# Altium schematic sheet SCH - Peripheral.SchDoc
size A4; CompanyName: James Cook University; DrawnBy1: Jacob Finger; Organization: James Cook University; Title1: AS1 SCH - Peripherals; Revision: 1.2; SheetNumber: 2; SheetTotal: 3; Title2: Mic, Oscillator, IMUs & Switch; DrawnBy2: Liam McLaren; ProjectName: *ProjectName
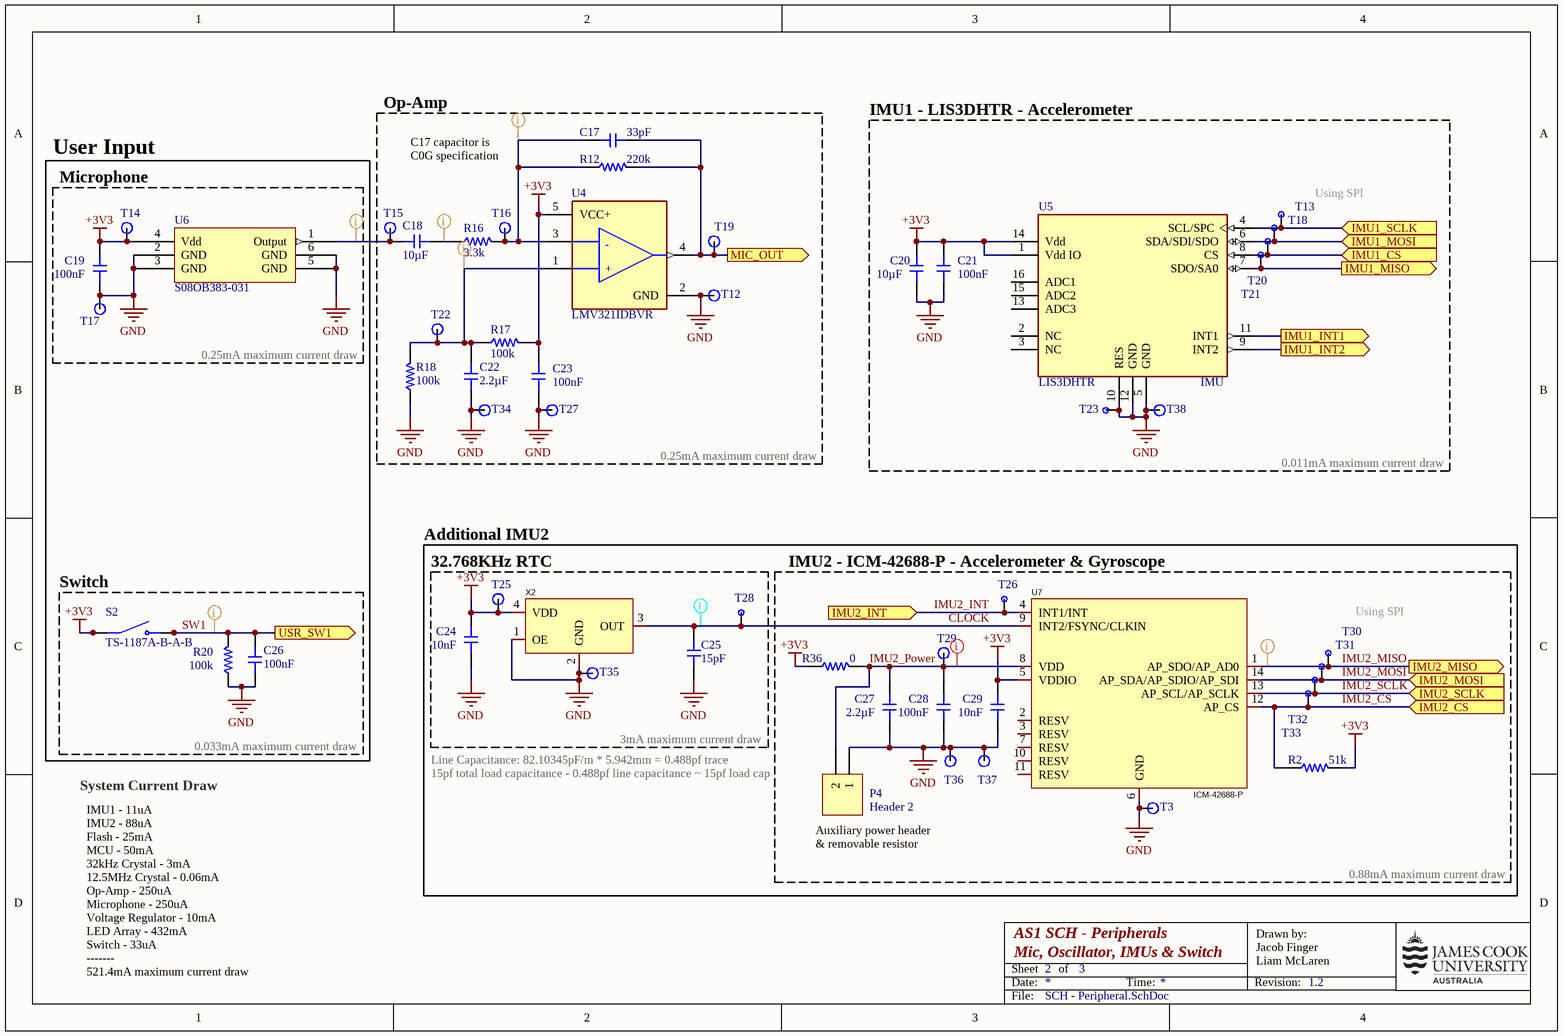
[diagram p0: SCH - Peripheral.SchDoc]

## Parts
C17  value 33pF  [CAP-0402]  (hidden comment: 0402CG330J500NT)
C18  value 10µF  [CAP-0402]  (hidden comment: CL05A106MQ5NUNC)
C19  value 100nF  [CAP-0402]  (hidden comment: CL05B104KB54PNC)
C20  value 10µF  [CAP-0402]  (hidden comment: CL05A106MQ5NUNC)
C21  value 100nF  [CAP-0402]  (hidden comment: CL05B104KB54PNC)
C22  value 2.2µF  [CAP-0402]  (hidden comment: CL05A225MQ5NSNC)
C23  value 100nF  [CAP-0402]  (hidden comment: CL05B104KB54PNC)
C24  value 10nF  [CAP-0402]  (hidden comment: CL05B103KB5NNNC)
C25  value 15pF  [CAP-0402]  (hidden comment: 0402CG150J500NT)
C26  value 100nF  [CAP-0402]  (hidden comment: CL05B104KO5NNNC)
C27  value 2.2µF  [CAP-0402]  (hidden comment: CL05A225MQ5NSNC)
C28  value 100nF  [CAP-0402]  (hidden comment: CL05B104KB54PNC)
C29  value 10nF  [CAP-0402]  (hidden comment: CL05B103KB5NNNC)
P4  Header 2  [HDR1X2]  (no BOM)
R2  value 51k  [RES-0402]  (hidden comment: 0402WGF5102TCE)
R12  value 220k  [RES-0603]  (hidden comment: 0603WAF2203T5E)
R16  value 3.3k  [RES-0402]  (hidden comment: 0402WGF3301TCE)
R17  value 100k  [RES-0402]  (hidden comment: 0402WGF1003TCE)
R18  value 100k  [RES-0402]  (hidden comment: 0402WGF1003TCE)
R20  value 100k  [RES-0402]  (hidden comment: 0402WGF1003TCE)
R36  value 0  [RES-0402]  (hidden comment: 0402WGF0000TCE)
S2  TS-1187A-B-A-B  [SW_TS-1187A-B-A-B]
T3  TP  [TestPoint]  (value not drawn)  (no BOM)
T12  TP  [TestPoint]  (value not drawn)  (no BOM)
T13  TP  [TestPoint - Small]  (value not drawn)  (no BOM)
T14  TP  [TestPoint]  (value not drawn)  (no BOM)
T15  TP  [TestPoint]  (value not drawn)  (no BOM)
T16  TP  [TestPoint]  (value not drawn)  (no BOM)
T17  TP  [TestPoint]  (value not drawn)  (no BOM)
T18  TP  [TestPoint - Small]  (value not drawn)  (no BOM)
T19  TP  [TestPoint]  (value not drawn)  (no BOM)
T20  TP  [TestPoint - Small]  (value not drawn)  (no BOM)
T21  TP  [TestPoint - Small]  (value not drawn)  (no BOM)
T22  TP  [TestPoint]  (value not drawn)  (no BOM)
T23  TP  [TestPoint - Small]  (value not drawn)  (no BOM)
T25  TP  [TestPoint]  (value not drawn)  (no BOM)
T26  TP  [TestPoint - Small]  (value not drawn)  (no BOM)
T27  TP  [TestPoint]  (value not drawn)  (no BOM)
T28  TP  [TestPoint - Small]  (value not drawn)  (no BOM)
T29  TP  [TestPoint]  (value not drawn)  (no BOM)
T30  TP  [TestPoint - Small]  (value not drawn)  (no BOM)
T31  TP  [TestPoint - Small]  (value not drawn)  (no BOM)
T32  TP  [TestPoint - Small]  (value not drawn)  (no BOM)
T33  TP  [TestPoint - Small]  (value not drawn)  (no BOM)
T34  TP  [TestPoint]  (value not drawn)  (no BOM)
T35  TP  [TestPoint]  (value not drawn)  (no BOM)
T36  TP  [TestPoint]  (value not drawn)  (no BOM)
T37  TP  [TestPoint]  (value not drawn)  (no BOM)
T38  TP  [TestPoint]  (value not drawn)  (no BOM)
U4  LMV321IDBVR  [FP-DBV0005A-MFG]
U5  LIS3DHTR  [FP-LGA-16-7983231-MFG]
U6  S08OB383-031  [Goertek_S08OB381-026]
U7  IMU IC  [LGA-14_L3.0-W2.5-P0.50-TL]  (value not drawn)
X2  HSO221S RTC  [OSC-SMD_4P-L2.5-W2.0-BL]  (value not drawn)

## Blocks framed on the sheet
Op-Amp: C17 C18 C22 C23 R12 R16-R18 T12 T15 T16 T19 T22 T27 T34 U4
IMU1 - LIS3DHTR - Accelerometer: C20 C21 T13 T18 T20 T21 T23 T38 U5
Microphone: C19 T14 T17 U6
Switch: C26 R20 S2
32.768KHz RTC: C24 C25 T25 T28 T35 X2
IMU2 - ICM-42688-P - Accelerometer & Gyroscope: C27-C29 P4 R2 R36 T3 T26 T29-T33 T36 T37 U7

## Ports
IMU1_CS (in, see SCH - Inputs and Intermediary[2B]), IMU1_INT1 (out, see SCH - Inputs and Intermediary[2B]), IMU1_INT2 (out, see SCH - Inputs and Intermediary[2B]), IMU1_MISO (out, see SCH - Inputs and Intermediary[2B]), IMU1_MOSI (in, see SCH - Inputs and Intermediary[2B]), IMU1_SCLK (in, see SCH - Inputs and Intermediary[2B]), IMU2_CS (in, see SCH - Inputs and Intermediary[3C]), IMU2_INT (in, see SCH - Inputs and Intermediary[3C]), IMU2_MISO (out, see SCH - Inputs and Intermediary[3C]), IMU2_MOSI (in, see SCH - Inputs and Intermediary[3C]), IMU2_SCLK (in, see SCH - Inputs and Intermediary[3C]), MIC_OUT (out, see SCH - Inputs and Intermediary[2C]), USR_SW1 (out, see SCH - Inputs and Intermediary[2D])

## Nets
+3V3: C19.2 C20.1 C21.2 C23.2 C24.2 C29.2 R2.2 R17.2 R36.1 S2.A(COM) S2.B(COM) T14.1(TP) T25.1(TP) U4.5(VCC+) U5.1(Vdd_IO) U5.14(Vdd) U6.4(Vdd) U7.5(VDDIO) X2.4(VDD)
GND: C19.1 C20.2 C21.1 C22.1 C23.1 C24.1 C25.1 C26.1 C27.1 C28.1 C29.1 P4.1 R18.1 R20.1 T3.1(TP) T12.1(TP) T17.1(TP) T23.1(TP) T27.1(TP) T34.1(TP) T35.1(TP) T36.1(TP) T37.1(TP) T38.1(TP) U4.2(GND) U5.5(GND) U5.10(RES) U5.12(GND) U6.2(GND) U6.3(GND) U6.5(GND) U6.6(GND) U7.6(GND) X2.1(OE) X2.2(GND)
CLOCK: C25.2 T28.1(TP) U7.9(INT2/FSYNC/CLKIN) X2.3(OUT)
IMU1_CS: T20.1(TP) U5.8(CS) ; port IMU1_CS
IMU1_INT1: U5.11(INT1) ; port IMU1_INT1
IMU1_INT2: U5.9(INT2) ; port IMU1_INT2
IMU1_MISO: T21.1(TP) U5.7(SDO/SA0) ; port IMU1_MISO
IMU1_MOSI: T18.1(TP) U5.6(SDA/SDI/SDO) ; port IMU1_MOSI
IMU1_SCLK: T13.1(TP) U5.4(SCL/SPC) ; port IMU1_SCLK
IMU2_CS: R2.1 T33.1(TP) U7.12(AP_CS) ; port IMU2_CS
IMU2_INT: T26.1(TP) U7.4(INT1/INT) ; port IMU2_INT
IMU2_MISO: T30.1(TP) U7.1(AP_SDO/AP_AD0) ; port IMU2_MISO
IMU2_MOSI: T31.1(TP) U7.14(AP_SDA/AP_SDIO/AP_SDI) ; port IMU2_MOSI
IMU2_Power: C27.2 C28.2 P4.2 R36.2 T29.1(TP) U7.8(VDD)
IMU2_SCLK: T32.1(TP) U7.13(AP_SCL/AP_SCLK) ; port IMU2_SCLK
MIC_OUT: C17.2 R12.2 T19.1(TP) U4.4(OUT) ; port MIC_OUT
SW1: C26.2 R20.2 S2.C(NO) S2.D(NO) ; port USR_SW1
NetC17_1: C17.1 R12.1 R16.2 T16.1(TP) U4.3(1IN-)
NetC18_1: C18.1 T15.1(TP) U6.1(Output)
NetC18_2: C18.2 R16.1
NetC22_2: C22.2 R17.1 R18.2 T22.1(TP) U4.1(1IN+)

Not connected (* = marked no-connect by the designer): U5 2(NC) 3(NC) 13(ADC3) 15(ADC2) 16(ADC1); U7 2(RESV) 3(RESV) 7(RESV) 10(RESV) 11(RESV)

## Layout directives
net class Signals: IMU2_MISO, NetC17_1, NetC18_1, NetC18_2, NetC22_2, SW1
net class Clock: CLOCK
net class Power: IMU2_Power

## Notes on the sheet
- User Input
- C17 capacitor is C0G specification
- Using SPI
- (near R18) 0.25mA maximum current draw
- (near U5) IMU
- 0.25mA maximum current draw
- 0.011mA maximum current draw
- Additional IMU2
- System Current Draw
- 0.033mA maximum current draw
- (near P4) 15pf total load capacitance - 0.488pf line capacitance ~ 15pf load cap
- Line Capacitance: 82.10345pF/m * 5.942mm = 0.488pf trace
- 3mA maximum current draw
- Auxiliary power header & removable resistor
- 0.88mA maximum current draw
- IMU1 - 11uA
  IMU2 - 88uA
  Flash - 25mA
  MCU - 50mA
  32kHz Crystal - 3mA
  12.5MHz Crystal - 0.06mA
  Op-Amp - 250uA
  Microphone - 250uA
  Voltage Regulator - 10mA
  LED Array - 432mA
  Switch - 33uA
  -------
  521.4mA maximum current draw
- Date:
- Sheet
- of
- Time:
- Revision:
- Drawn by:
- File:
- (in symbol CMP-00012-2) +

## Library data of the parts
C17 = CMP-001-00127-3: Capacitor, Ceramic (MLCC), 33pF, ±5%, 50V, C0G, ±5%, SMD 0402; Manufacturer: FH(Guangdong Fenghua Advanced Tech); ComponentLink3URL: https://lcsc.com/product-detail/Multilayer-Ceramic-Capacitors-MLCC---SMD-SMT_FH-Guangdong-Fenghua-Advanced-Tech-FH-Guangdong-Fenghua-Advanced-Tech-0402CG330J500NT_C1562.html; Tolerance: 5%; ComponentLink1URL: https://datasheet.lcsc.com/lcsc/1811141731_FH--Guangdong-Fenghua-Advanced-Tech-0402CG330J500NT_C1562.pdf; Source: jlcpcb_capacitors_basic.schlib; ComponentLink2URL: https://jlcpcb.com/partdetail/C1562; ComponentLink2Description: JLCPCB Part URL; RoHS: Yes; Design Item ID: 0402CG330J500NT; Manufacturer Part Number: 0402CG330J500NT; Voltage Rating: 50V; JLCPCB Basic Part: Yes; Case/Package: 0402; Category: Capacitors - MLCC; ComponentLink3Description: LCSC Part URL; JLCPCB Part Number: C1562; ComponentLink1Description: Datasheet; Temperature Coefficient: C0G
C18 C20 = CMP-001-00141-3: Capacitor, Ceramic (MLCC), 10uF, ±20%, 6.3V, X5R, ±20%, SMD 0402; Manufacturer: Samsung Electro-Mechanics; JLCPCB Part Number: C15525; Tolerance: 20%; Temperature Coefficient: X5R; ComponentLink2Description: JLCPCB Part URL; ComponentLink3Description: LCSC Part URL; Voltage Rating: 6.3V; ComponentLink1Description: Datasheet; ComponentLink1URL: https://datasheet.lcsc.com/lcsc/2208231630_Samsung-Electro-Mechanics-CL05A106MQ5NUNC_C15525.pdf; RoHS: Yes; Case/Package: 0402; ComponentLink2URL: https://jlcpcb.com/partdetail/C15525; Manufacturer Part Number: CL05A106MQ5NUNC; Design Item ID: CL05A106MQ5NUNC; Source: jlcpcb_capacitors_basic.schlib; Category: Capacitors - MLCC; ComponentLink3URL: https://lcsc.com/product-detail/Multilayer-Ceramic-Capacitors-MLCC---SMD-SMT_Samsung-Electro-Mechanics-Samsung-Electro-Mechanics-CL05A106MQ5NUNC_C15525.html; JLCPCB Basic Part: Yes
C19 C21 C23 C28 = CMP-001-00146-3: Capacitor, Ceramic (MLCC), 100nF, ±10%, 50V, X7R, ±10%, SMD 0402; Manufacturer: Samsung Electro-Mechanics; Design Item ID: CL05B104KB54PNC; Source: jlcpcb_capacitors_basic.schlib; Case/Package: 0402; Temperature Coefficient: X7R; ComponentLink3URL: https://lcsc.com/product-detail/Multilayer-Ceramic-Capacitors-MLCC---SMD-SMT_Samsung-Electro-Mechanics-Samsung-Electro-Mechanics-CL05B104KB54PNC_C307331.html; Manufacturer Part Number: CL05B104KB54PNC; RoHS: Yes; ComponentLink1Description: Datasheet; Voltage Rating: 50V; ComponentLink2Description: JLCPCB Part URL; JLCPCB Basic Part: Yes; Category: Capacitors - MLCC; ComponentLink3Description: LCSC Part URL; ComponentLink2URL: https://jlcpcb.com/partdetail/C307331; JLCPCB Part Number: C307331; Tolerance: 10%; ComponentLink1URL: https://datasheet.lcsc.com/lcsc/1810191222_Samsung-Electro-Mechanics-CL05B104KB54PNC_C307331.pdf
C22 C27 = CMP-001-00142-3: Capacitor, Ceramic (MLCC), 2.2uF, ±20%, 6.3V, X5R, ±20%, SMD 0402; Manufacturer: Samsung Electro-Mechanics; Manufacturer Part Number: CL05A225MQ5NSNC; ComponentLink2URL: https://jlcpcb.com/partdetail/C12530; ComponentLink3URL: https://lcsc.com/product-detail/Multilayer-Ceramic-Capacitors-MLCC---SMD-SMT_Samsung-Electro-Mechanics-Samsung-Electro-Mechanics-CL05A225MQ5NSNC_C12530.html; RoHS: Yes; Design Item ID: CL05A225MQ5NSNC; Tolerance: 20%; JLCPCB Part Number: C12530; ComponentLink1Description: Datasheet; ComponentLink2Description: JLCPCB Part URL; ComponentLink1URL: https://datasheet.lcsc.com/lcsc/1811021410_Samsung-Electro-Mechanics-CL05A225MQ5NSNC_C12530.pdf; Voltage Rating: 6.3V; Case/Package: 0402; Source: jlcpcb_capacitors_basic.schlib; Category: Capacitors - MLCC; JLCPCB Basic Part: Yes; Temperature Coefficient: X5R; ComponentLink3Description: LCSC Part URL
C24 C29 = CMP-001-00145-3: Capacitor, Ceramic (MLCC), 10nF, ±10%, 50V, X7R, ±10%, SMD 0402; Manufacturer: Samsung Electro-Mechanics; JLCPCB Basic Part: Yes; JLCPCB Part Number: C15195; Case/Package: 0402; Voltage Rating: 50V; Design Item ID: CL05B103KB5NNNC; Category: Capacitors - MLCC; Tolerance: 10%; ComponentLink2Description: JLCPCB Part URL; ComponentLink3URL: https://lcsc.com/product-detail/Multilayer-Ceramic-Capacitors-MLCC---SMD-SMT_Samsung-Electro-Mechanics-Samsung-Electro-Mechanics-CL05B103KB5NNNC_C15195.html; ComponentLink2URL: https://jlcpcb.com/partdetail/C15195; Temperature Coefficient: X7R; Manufacturer Part Number: CL05B103KB5NNNC; ComponentLink1Description: Datasheet; Source: jlcpcb_capacitors_basic.schlib; ComponentLink3Description: LCSC Part URL; RoHS: Yes; ComponentLink1URL: https://datasheet.lcsc.com/lcsc/1810191223_Samsung-Electro-Mechanics-CL05B103KB5NNNC_C15195.pdf
C25 = CMP-001-00117-3: Capacitor, Ceramic (MLCC), 15pF, ±5%, 50V, C0G, ±5%, SMD 0402; Manufacturer: FH(Guangdong Fenghua Advanced Tech); Tolerance: 5%; Manufacturer Part Number: 0402CG150J500NT; ComponentLink3Description: LCSC Part URL; RoHS: Yes; Case/Package: 0402; JLCPCB Part Number: C1548; ComponentLink1Description: Datasheet; Source: jlcpcb_capacitors_basic.schlib; JLCPCB Basic Part: Yes; ComponentLink2URL: https://jlcpcb.com/partdetail/C1548; Voltage Rating: 50V; ComponentLink1URL: https://datasheet.lcsc.com/lcsc/1810111610_FH--Guangdong-Fenghua-Advanced-Tech-0402CG150J500NT_C1548.pdf; Category: Capacitors - MLCC; Design Item ID: 0402CG150J500NT; Temperature Coefficient: C0G; ComponentLink3URL: https://lcsc.com/product-detail/Multilayer-Ceramic-Capacitors-MLCC---SMD-SMT_FH-Guangdong-Fenghua-Advanced-Tech-FH-Guangdong-Fenghua-Advanced-Tech-0402CG150J500NT_C1548.html; ComponentLink2Description: JLCPCB Part URL
C26 = CMP-001-00147-3: Capacitor, Ceramic (MLCC), 100nF, ±10%, 16V, X7R, ±10%, SMD 0402; Manufacturer: Samsung Electro-Mechanics; Manufacturer Part Number: CL05B104KO5NNNC; ComponentLink1Description: Datasheet; RoHS: Yes; Voltage Rating: 16V; ComponentLink2URL: https://jlcpcb.com/partdetail/C1525; Temperature Coefficient: X7R; ComponentLink2Description: JLCPCB Part URL; JLCPCB Part Number: C1525; ComponentLink3URL: https://lcsc.com/product-detail/Multilayer-Ceramic-Capacitors-MLCC---SMD-SMT_Samsung-Electro-Mechanics-Samsung-Electro-Mechanics-CL05B104KO5NNNC_C1525.html; ComponentLink3Description: LCSC Part URL; Source: jlcpcb_capacitors_basic.schlib; Design Item ID: CL05B104KO5NNNC; Category: Capacitors - MLCC; ComponentLink1URL: https://datasheet.lcsc.com/lcsc/1810191219_Samsung-Electro-Mechanics-CL05B104KO5NNNC_C1525.pdf; JLCPCB Basic Part: Yes; Tolerance: 10%; Case/Package: 0402
P4 = CMP-002-00097-1: Header, 2-Pin; Signal Integrity: Connector; LatestRevisionDate: 17-Jul-2002; Publisher: Altium Limited; Pin Count: 2; Design Item ID: Header 2; LatestRevisionNote: Re-released for DXP Platform.; Source: Miscellaneous Connectors.SchLib; Component Type: Standard
R2 = CMP-009-00226-4: Resistor, 51kΩ, ±1%, 62.5mW, 50V, ±100ppm/℃, -55℃~+155℃, SMD 0402; Manufacturer: Uniroyal; ComponentLink2URL: https://jlcpcb.com/partdetail/C25794; ComponentLink2Description: JLCPCB Part URL; Case/Package: 0402; Manufacturer Part Number: 0402WGF5102TCE; ComponentLink1Description: Datasheet; Source: jlcpcb_resistors_basic.schlib; JLCPCB Part Number: C25794; Power Rating: 62.5mW; Temperature Rating: -55℃~+155℃; Design Item ID: 0402WGF5102TCE; JLCPCB Basic Part: Yes; Category: Resistors; Voltage Rating: 50V; Tolerance: 1%; Temperature Coefficient: ±100ppm/℃; ComponentLink1URL: https://datasheet.lcsc.com/lcsc/2206010100_UNI-ROYAL-Uniroyal-Elec-0402WGF5102TCE_C25794.pdf
R12 = CMP-009-00277-2: Resistor, 220kΩ, ±1%, 100mW, 75V, ±100ppm/℃, -55℃~+155℃, SMD 0603; Manufacturer: Uniroyal; Temperature Coefficient: ±100ppm/℃; Tolerance: 1%; ComponentLink2URL: https://jlcpcb.com/partdetail/C22961; Source: jlcpcb_resistors_basic.schlib; Case/Package: 0603; Category: Resistors; Manufacturer Part Number: 0603WAF2203T5E; Voltage Rating: 75V; Design Item ID: 0603WAF2203T5E; ComponentLink1URL: https://datasheet.lcsc.com/lcsc/2206010130_UNI-ROYAL-Uniroyal-Elec-0603WAF2203T5E_C22961.pdf; JLCPCB Part Number: C22961; Power Rating: 100mW; ComponentLink1Description: Datasheet; ComponentLink2Description: JLCPCB Part URL; Temperature Rating: -55℃~+155℃; JLCPCB Basic Part: Yes
R16 = CMP-009-00211-4: Resistor, 3.3kΩ, ±1%, 62.5mW, 50V, ±100ppm/℃, -55℃~+155℃, SMD 0402; Manufacturer: Uniroyal; JLCPCB Part Number: C25890; Design Item ID: 0402WGF3301TCE; Temperature Rating: -55℃~+155℃; Voltage Rating: 50V; JLCPCB Basic Part: Yes; Power Rating: 62.5mW; Source: jlcpcb_resistors_basic.schlib; ComponentLink2Description: JLCPCB Part URL; Temperature Coefficient: ±100ppm/℃; Case/Package: 0402; ComponentLink1URL: https://datasheet.lcsc.com/lcsc/2206010045_UNI-ROYAL-Uniroyal-Elec-0402WGF3301TCE_C25890.pdf; Manufacturer Part Number: 0402WGF3301TCE; ComponentLink2URL: https://jlcpcb.com/partdetail/C25890; ComponentLink1Description: Datasheet; Category: Resistors; Tolerance: 1%
R17 R18 R20 = CMP-009-00182-4: Resistor, 100kΩ, ±1%, 62.5mW, 50V, ±100ppm/℃, -55℃~+155℃, SMD 0402; Manufacturer: Uniroyal; ComponentLink1Description: Datasheet; Voltage Rating: 50V; ComponentLink2URL: https://jlcpcb.com/partdetail/C25741; Design Item ID: 0402WGF1003TCE; Tolerance: 1%; Case/Package: 0402; Manufacturer Part Number: 0402WGF1003TCE; ComponentLink2Description: JLCPCB Part URL; Source: jlcpcb_resistors_basic.schlib; JLCPCB Basic Part: Yes; Temperature Coefficient: ±100ppm/℃; Category: Resistors; Temperature Rating: -55℃~+155℃; JLCPCB Part Number: C25741; ComponentLink1URL: https://datasheet.lcsc.com/lcsc/2206010100_UNI-ROYAL-Uniroyal-Elec-0402WGF1003TCE_C25741.pdf; Power Rating: 62.5mW
R36 = CMP-009-00178-4: Resistor, 0Ω, ±1%, 62.5mW, 50V, ±800ppm/℃, -55℃~+155℃, SMD 0402; Manufacturer: Uniroyal; JLCPCB Part Number: C17168; Tolerance: 1%; Temperature Coefficient: ±800ppm/℃; ComponentLink1Description: Datasheet; ComponentLink1URL: https://datasheet.lcsc.com/lcsc/2206010216_UNI-ROYAL-Uniroyal-Elec-0402WGF0000TCE_C17168.pdf; Manufacturer Part Number: 0402WGF0000TCE; Voltage Rating: 50V; Case/Package: 0402; ComponentLink2URL: https://jlcpcb.com/partdetail/C17168; Temperature Rating: -55℃~+155℃; ComponentLink2Description: JLCPCB Part URL; Power Rating: 62.5mW; Category: Resistors; Source: jlcpcb_resistors_basic.schlib; JLCPCB Basic Part: Yes; Design Item ID: 0402WGF0000TCE
S2 = CMP-015-000000-1: SPST 50mA @ 12VDC Top Actuated Round Button 160gf SMD Tactile Switches RoHS; Availability: Unavailable; JLCPCB Part: C318884; Value: *; Price: None; Design Item ID: TS-1187A-B-A-B; Component Type: Standard; Pin Count: 4; Source: TS-1187A-B-A-B.SchLib; MP: TS-1187A-B-A-B; Package: None
T3 T12 T14-T17 T19 T22 T25 T27 T29 T34-T38 = TestPoint
T13 T18 T20 T21 T23 T26 T28 T30-T33 = TestPoint Small
U4 = CMP-00012-2: General Purpose Amplifier 1 Circuit Rail-to-Rail SOT-23-5; Input Offset Voltage (Vos): 7mV; Number of Amplifiers: 1; Input Bias Current: 250nA; Max Supply Voltage: 5.5V; Min Supply Voltage: 2.7V; Voltage Gain: 100dB; Supply Current: 250uA; Operating Supply Current: 130uA; Output Current: 160mA; Power Supply Rejection Ratio (PSRR): 50dB; Unity Gain Bandwidth Product: 1MHz; Slew Rate: 1V/µs; Radiation Hardening: No; Case/Package: SOT-23-5; Amplifier Type: GENERAL PURPOSE; Contact Plating: Tin,Matte; Packaging: Tape and Reel; Number of Circuits: 1; Nominal Supply Current: 250uA; Mount: Surface Mount; Technology: BICMOS; JLCPCB Part: C7972; Series: -; REACH SVHC: No SVHC; Output Current per Channel: 160mA; Max Operating Temperature: 125°C; Number of Elements: 1; Number of Channels: 1; Number of Pins: 5; Lead Free: Lead Free; Bandwidth: 1MHz; Gain Bandwidth Product: 1MHz; RoHS Compliant: Yes; Min Operating Temperature: -40°C; Common Mode Rejection Ratio: 50dB; Package Quantity: 1
U5 = CMP-00010-2: ACCEL 2-16G I2C/SPI 16LGA; Interface: I2C; Max Supply Voltage: 3.6V; Axis: X, Y, Z; Operating Supply Voltage: 2.5V; Bandwidth: 5kHz; Resolution: 16b; Operating Supply Current: 11uA; Sensor Type: 3 Axis; Min Supply Voltage: 1.71V; Output Type: Digital; Series: -; Number of Pins: 16; Radiation Hardening: No; Package Quantity: 1; Case/Package: LGA; Contact Plating: Gold; Min Operating Temperature: -40°C; REACH SVHC: No SVHC; RoHS Compliant: Yes; Lead Free: Lead Free; Min Supply Voltage (DC): 1.71V; Length: 3mm; JLCPCB Part: C15134; Height: 1mm; Max Supply Voltage (DC): 3.6V; Width: 3mm; Max Operating Temperature: 85°C; Depth: 3mm; Packaging: Tape and Reel
U6 = CMP-00027-00000-1: MEMS Microphone SMD 3.76x3x1.1mm; JLCPCB Part: C233789
U7 = ICM-42688-P: ICM-42688-P LGA-14(2.5x3) Attitude Sensor/Gyroscope; Manufacturer: TDK InvenSense(应美盛); Add into BOM: yes; Sensor Type: 加速度计陀螺仪; LCSC Part Name: ICM-42688-P; Supplier Part: C1850418; Manufacturer Part: ICM-42688-P; JLCPCB Part Class: Extended Part; Datasheet: https://atta.szlcsc.com/upload/public/pdf/source/20210703/CF24204867ACE5B754A2B035F23E5931.pdf; Supplier: LCSC; Convert to PCB: yes; Device: ICM-42688-P; Symbol: ICM-42688-P; LCSC Part #: C1850418; JLCPCB Part #: C1850418; Supplier Footprint: LGA-14(2.5x3)
X2 = S2H32768KF3CHC-IT: HSO221S RTC - 3.3V 3mA ±30ppm 32.768kHz SMD2520-4P Oscillators ROHS; Manufacturer: HELE(台湾加高); Add into BOM: yes; Symbol: S2H32768KF3CHC-IT; Device: S2H32768KF3CHC-IT; LCSC Part Name: S2H32768KF3CHC-IT; Supplier Part: C253914; Manufacturer Part: S2H32768KF3CHC-IT; JLCPCB Part Class: Extended Part; Datasheet: https://atta.szlcsc.com/upload/public/pdf/source/20190430/C253914_C770A64EFF6E6E62846100D666617C6C.pdf; Supplier: LCSC; Convert to PCB: yes; Value: 32.768kHz; Supply Voltage: 3.3V; Supply Current (Max): 3mA; Frequency Stability(Full temperature range): ±30ppm; Operating Temperature: -30℃~+85℃; LCSC Part #: C253914; JLCPCB Part #: C253914; Supplier Footprint: SMD2520-4P